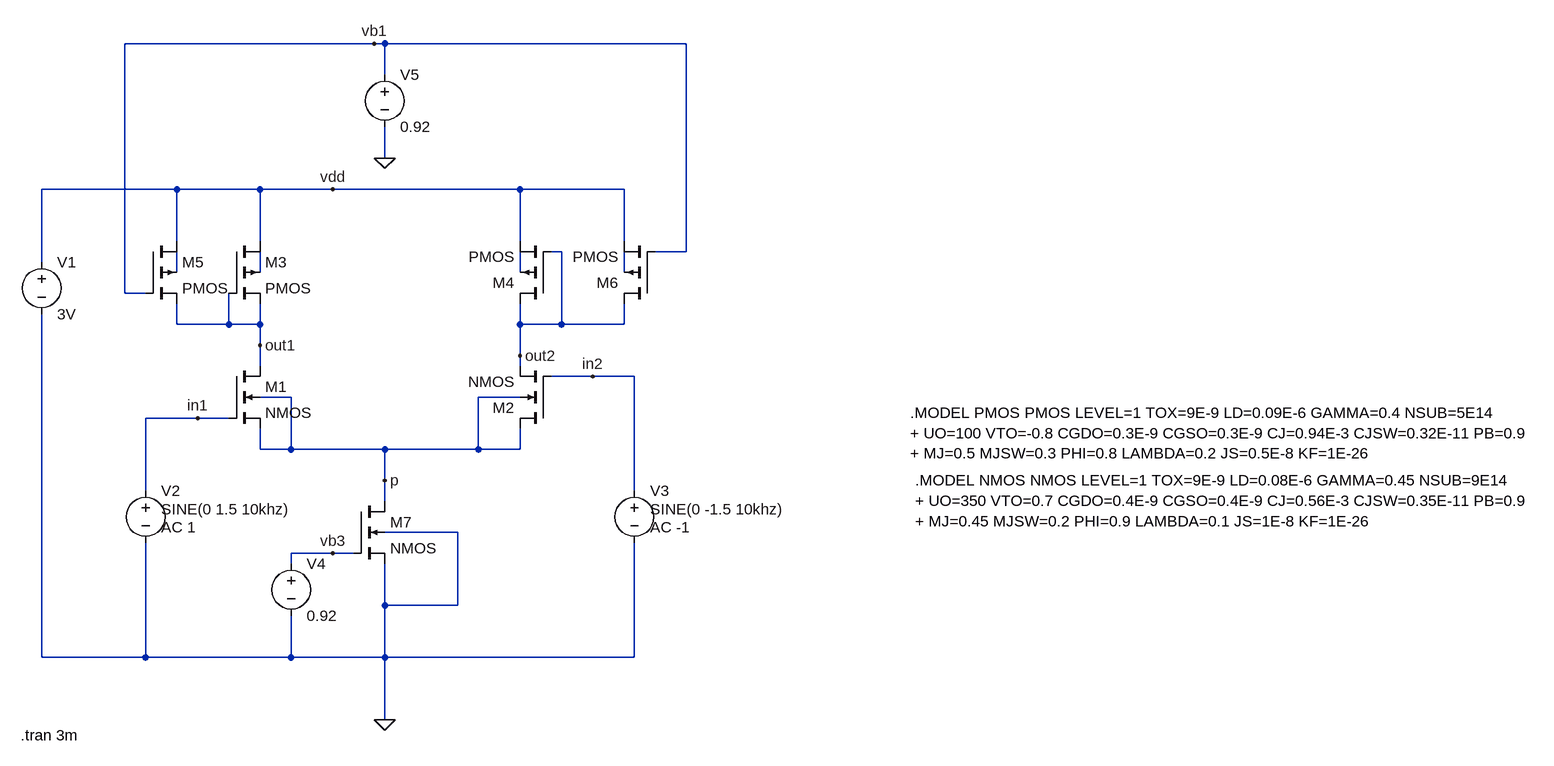
[diagram p0: schematic Draft1.asc]
Draft1.asc, the LTspice schematic file:
Version 4
SHEET 1 3464 792
WIRE 1632 -336 1248 -336
WIRE 1648 -336 1632 -336
WIRE 2112 -336 1648 -336
WIRE 1648 -288 1648 -336
WIRE 1648 -160 1648 -208
WIRE 1328 -112 1120 -112
WIRE 1456 -112 1328 -112
WIRE 1568 -112 1456 -112
WIRE 1856 -112 1568 -112
WIRE 2016 -112 1856 -112
WIRE 1328 -32 1328 -112
WIRE 1456 -32 1456 -112
WIRE 1856 -32 1856 -112
WIRE 2016 -32 2016 -112
WIRE 1920 -16 1904 -16
WIRE 2112 -16 2112 -336
WIRE 2112 -16 2064 -16
WIRE 1120 0 1120 -112
WIRE 1328 16 1328 -16
WIRE 1456 16 1456 -16
WIRE 1856 16 1856 -16
WIRE 2016 16 2016 -16
WIRE 1248 48 1248 -336
WIRE 1280 48 1248 48
WIRE 1328 96 1328 64
WIRE 1408 96 1408 48
WIRE 1408 96 1328 96
WIRE 1456 96 1456 64
WIRE 1456 96 1408 96
WIRE 1856 96 1856 64
WIRE 1920 96 1920 -16
WIRE 1920 96 1856 96
WIRE 2016 96 2016 64
WIRE 2016 96 1920 96
WIRE 1456 128 1456 96
WIRE 1856 144 1856 96
WIRE 1456 160 1456 128
WIRE 1856 160 1856 144
WIRE 1968 176 1904 176
WIRE 2032 176 1968 176
WIRE 1504 208 1456 208
WIRE 1856 208 1792 208
WIRE 1360 240 1280 240
WIRE 1408 240 1360 240
WIRE 1456 288 1456 256
WIRE 1504 288 1504 208
WIRE 1504 288 1456 288
WIRE 1648 288 1504 288
WIRE 1792 288 1792 208
WIRE 1792 288 1648 288
WIRE 1856 288 1856 256
WIRE 1856 288 1792 288
WIRE 1648 336 1648 288
WIRE 1280 352 1280 240
WIRE 2032 352 2032 176
WIRE 1648 368 1648 336
WIRE 1760 416 1648 416
WIRE 1568 448 1504 448
WIRE 1600 448 1568 448
WIRE 1504 464 1504 448
WIRE 1648 528 1648 464
WIRE 1760 528 1760 416
WIRE 1760 528 1648 528
WIRE 1120 608 1120 80
WIRE 1280 608 1280 432
WIRE 1280 608 1120 608
WIRE 1504 608 1504 544
WIRE 1504 608 1280 608
WIRE 1648 608 1648 528
WIRE 1648 608 1504 608
WIRE 2032 608 2032 432
WIRE 2032 608 1648 608
WIRE 1648 704 1648 608
FLAG 1648 704 0
FLAG 1648 336 p
FLAG 1648 -160 0
FLAG 1568 -112 vdd
FLAG 1632 -336 vb1
FLAG 1456 128 out1
FLAG 1856 144 out2
FLAG 1360 240 in1
FLAG 1968 176 in2
FLAG 1568 448 vb3
SYMBOL nmos4 1408 160 R0
SYMATTR InstName M1
SYMATTR Value2 l=2u w=33u ad=3300p as=99p pd=266u ps=72u
SYMBOL pmos4 1408 -32 R0
SYMATTR InstName M3
SYMATTR Value2 l=2u w=50u ad=3000p as=150p pd=220u ps=106u
SYMBOL voltage 1120 -16 R0
WINDOW 123 0 0 Left 0
WINDOW 39 0 0 Left 0
SYMATTR InstName V1
SYMATTR Value 3V
SYMBOL voltage 1280 336 R0
WINDOW 123 24 72 Left 2
WINDOW 39 0 0 Left 0
WINDOW 3 24 44 Left 2
SYMATTR Value2 AC 1
SYMATTR Value SINE(0 1.5 10khz)
SYMATTR InstName V2
SYMBOL pmos4 1904 64 R180
SYMATTR InstName M4
SYMATTR Value2 l=2u w=50u ad=3000p as=150p pd=220u ps=106u
SYMBOL nmos4 1904 256 R180
SYMATTR InstName M2
SYMATTR Value2 l=2u w=33u ad=3300p as=99p pd=266u ps=72u
SYMBOL nmos4 1600 368 R0
SYMATTR InstName M7
SYMATTR Value2 l=2u w=100u ad=300p as=300p pd=206u ps=206u
SYMBOL voltage 2032 336 R0
WINDOW 123 24 72 Left 2
WINDOW 39 0 0 Left 0
WINDOW 3 24 44 Left 2
SYMATTR Value2 AC -1
SYMATTR Value SINE(0 -1.5 10khz)
SYMATTR InstName V3
SYMBOL voltage 1504 448 R0
WINDOW 123 0 0 Left 0
WINDOW 39 0 0 Left 0
SYMATTR InstName V4
SYMATTR Value 0.92
SYMBOL pmos4 1280 -32 R0
SYMATTR InstName M5
SYMATTR Value2 l=2u w=6u ad=24p as=24p pd=20u ps=20u
SYMBOL pmos4 2064 64 R180
SYMATTR InstName M6
SYMATTR Value2 l=2u w=6u ad=24p as=24p pd=20u
SYMBOL voltage 1648 -304 R0
WINDOW 123 0 0 Left 0
WINDOW 39 0 0 Left 0
SYMATTR InstName V5
SYMATTR Value 0.92
TEXT 2464 336 Left 2 !.MODEL NMOS NMOS LEVEL=1 TOX=9E-9 LD=0.08E-6 GAMMA=0.45 NSUB=9E14\n+ UO=350 VTO=0.7 CGDO=0.4E-9 CGSO=0.4E-9 CJ=0.56E-3 CJSW=0.35E-11 PB=0.9\n+ MJ=0.45 MJSW=0.2 PHI=0.9 LAMBDA=0.1 JS=1E-8 KF=1E-26
TEXT 2456 232 Left 2 !.MODEL PMOS PMOS LEVEL=1 TOX=9E-9 LD=0.09E-6 GAMMA=0.4 NSUB=5E14\n+ UO=100 VTO=-0.8 CGDO=0.3E-9 CGSO=0.3E-9 CJ=0.94E-3 CJSW=0.32E-11 PB=0.9\n+ MJ=0.5 MJSW=0.3 PHI=0.8 LAMBDA=0.2 JS=0.5E-8 KF=1E-26
TEXT 1088 728 Left 2 !.tran 3m

The netlist it stands for:
* Draft1.asc
M1 out1 in1 p p NMOS l=2u w=33u ad=3300p as=99p pd=266u ps=72u
M3 vdd out1 out1 N002 PMOS l=2u w=50u ad=3000p as=150p pd=220u ps=106u
V1 vdd 0 3V
V2 in1 0 SINE(0 1.5 10khz) AC 1
M4 out2 out2 vdd N003 PMOS l=2u w=50u ad=3000p as=150p pd=220u ps=106u
M2 p in2 out2 p NMOS l=2u w=33u ad=3300p as=99p pd=266u ps=72u
M7 p vb3 0 0 NMOS l=2u w=100u ad=300p as=300p pd=206u ps=206u
V3 in2 0 SINE(0 -1.5 10khz) AC -1
V4 vb3 0 0.92
M5 vdd vb1 out1 N001 PMOS l=2u w=6u ad=24p as=24p pd=20u ps=20u
M6 out2 vb1 vdd N004 PMOS l=2u w=6u ad=24p as=24p pd=20u
V5 vb1 0 0.92
.model NMOS NMOS
.model PMOS PMOS
.lib standard.mos
.MODEL NMOS NMOS LEVEL=1 TOX=9E-9 LD=0.08E-6 GAMMA=0.45 NSUB=9E14
+ UO=350 VTO=0.7 CGDO=0.4E-9 CGSO=0.4E-9 CJ=0.56E-3 CJSW=0.35E-11 PB=0.9
+ MJ=0.45 MJSW=0.2 PHI=0.9 LAMBDA=0.1 JS=1E-8 KF=1E-26
.MODEL PMOS PMOS LEVEL=1 TOX=9E-9 LD=0.09E-6 GAMMA=0.4 NSUB=5E14
+ UO=100 VTO=-0.8 CGDO=0.3E-9 CGSO=0.3E-9 CJ=0.94E-3 CJSW=0.32E-11 PB=0.9
+ MJ=0.5 MJSW=0.3 PHI=0.8 LAMBDA=0.2 JS=0.5E-8 KF=1E-26
.tran 3m
.backanno
.end

* Results of the author's LTspice run, read from the files saved beside the schematic
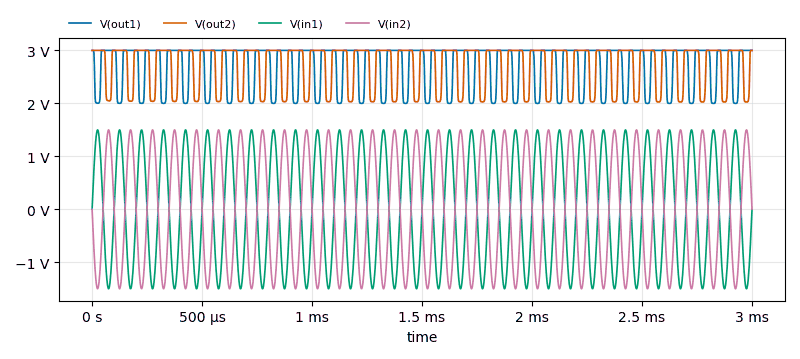
[diagram p1: Transient Analysis of Draft1.asc, plotted from the saved traces]
* Transient Analysis, 1 run:
*   V(out1): min 1.999 V, max 3 V, average 2.729 V, rms 2.761 V, last 3 V
*   V(out2): min 2.026 V, max 3 V, average 2.735 V, rms 2.765 V, last 3 V
*   V(in1): min -1.5 V, max 1.5 V, average -56.19 µV, rms 1.06 V, last 0 V
*   V(in2): min -1.5 V, max 1.5 V, average 56.19 µV, rms 1.06 V, last 0 V